# EAGLE design lm4811 (EAGLE 9.2.0)
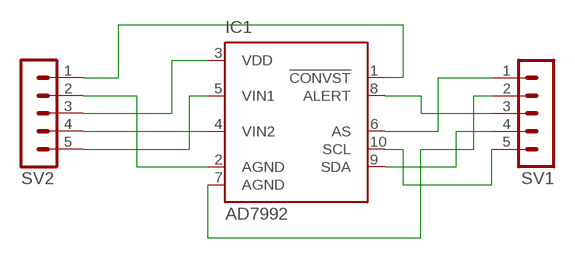
[diagram p0: schematic, sheet 1]

## Parts
IC1  AD7992  [MSOP10]
SV1  MA05-1  [MA05-1]
SV2  MA05-1  [MA05-1]

## Nets
N$1: IC1.1(!CONVST) SV2.1
N$2: IC1.2(AGND) SV2.2
N$3: IC1.3(VDD) SV2.3
N$4: IC1.4(VIN2) SV2.4
N$5: IC1.5(VIN1) SV2.5
N$6: IC1.6(AS) SV1.1
N$7: IC1.7(AGND) SV1.2
N$8: IC1.8(ALERT) SV1.3
N$9: IC1.9(SDA) SV1.4
N$10: IC1.10(SCL) SV1.5

## Library data of the parts
IC1 = analog-devices:AD7992: 2-Channel, 12-Bit ADC with I2C-Compatible Interface 10-Lead MSOP Source: http://www.analog.com/UploadedFiles/Data_Sheets/224965274AD7992_0.pdf; MPN: AD7992BRMZ-0; OC_FARNELL: 1078311; OC_NEWARK: 31M4422
SV1 SV2 = con-lstb:MA05-1: PIN HEADER; OC_FARNELL: unknown; OC_NEWARK: unknown

## Board
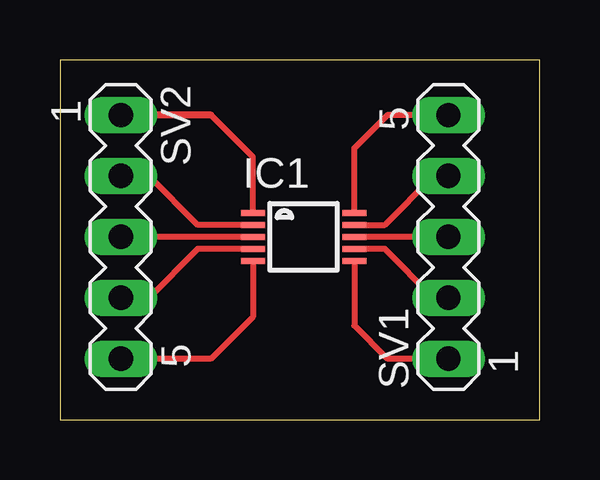
[diagram p1: board, top side]

Size 20 x 15 mm. Coordinates in mm from the lower left corner, seen from the top.
Outline: 0,0 20,0 20,15 0,15 0,0
Copper layers (1*16): Top 0.035mm / dielectric 1.5mm / Bottom 0.035mm
Design rules "default": minimum track width 6mil, minimum drill 0.35mm, track to track 6mil, track to pad 6mil, pad to pad 6mil, via to via 6mil, smd to smd 6mil, copper to edge 40mil, drill to drill 6mil, minimum pad ring 10mil, minimum via ring 8mil, stop-mask expansion 4mil, vias tented up to drill 0mil, thermal gap 10mil

### Footprints (pad centres in the part's own frame; a part is rotated, then mirrored left to right if it is on the bottom)
MSOP10 = smd 0.25 x 1: 1 -1,-2.113; 2 -0.5,-2.113; 3 0,-2.113; 4 0.5,-2.113; 5 1,-2.113; 6 1,2.113; 7 0.5,2.113; 8 0,2.113; 9 -0.5,2.113; 10 -1,2.113
MA05-1 = drill 1.016 long: 1 -5.08,0; 2 -2.54,0; 3 0,0; 4 2.54,0; 5 5.08,0

### Placement (x,y rotation side)
IC1  10.16,7.62 270 top
SV1  16.2,7.62 90 top
SV2  2.54,7.62 270 top

### Tracks (layer width: path | path; a pad name or v marks a point on that pad's centre or on a via)
N$1
  Top 0.25: IC1.1 8.05,10.95 6.3,12.7
  Top 0.3: 6.3,12.7 SV2.1
N$2
  Top 0.25: SV2.2 3.71,10.16 5.75,8.12 IC1.2
N$3
  Top 0.25: IC1.3 SV2.3
N$4
  Top 0.152: 3.71,5.08 SV2.4
  Top 0.25: IC1.4 5.75,7.12 3.71,5.08
N$5
  Top 0.25: IC1.5 8.05,4.29 6.3,2.54 SV2.5
N$6
  Top 0.25: SV1.1 13.66,2.54 12.27,3.93 IC1.6
N$7
  Top 0.25: IC1.7 13.54,7.12 15.58,5.08 SV1.2
N$8
  Top 0.25: SV1.3 IC1.8
N$9
  Top 0.25: IC1.9 13.54,8.12 15.58,10.16 SV1.4
N$10
  Top 0.25: IC1.10 12.27,11.31 13.66,12.7 SV1.5